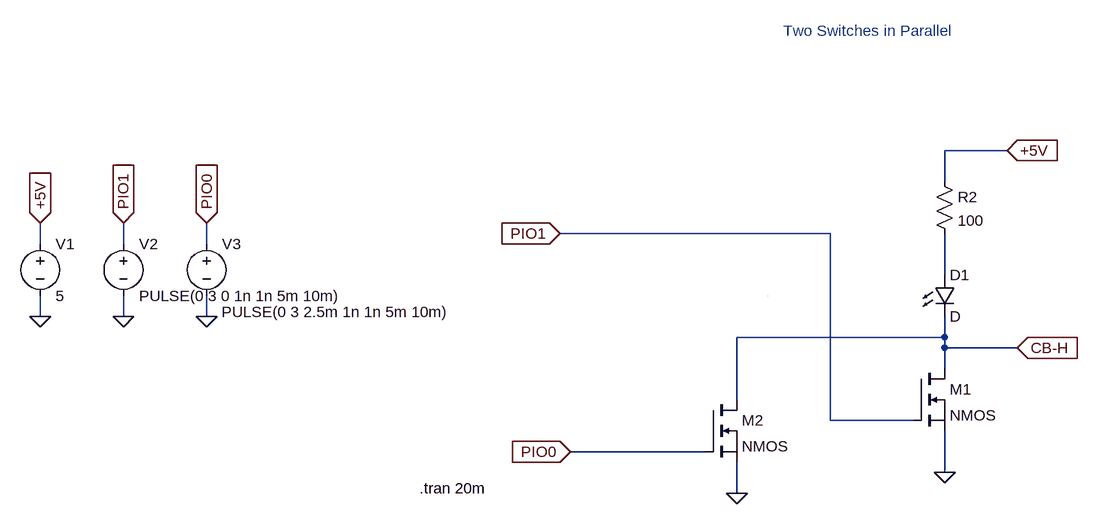
[diagram p0: schematic two_switches_parallel_ltspice.asc]
two_switches_parallel_ltspice.asc, the LTspice schematic file:
Version 4
SHEET 1 880 680
WIRE 368 -224 272 -224
WIRE 272 -176 272 -224
WIRE 96 -96 -320 -96
WIRE -1120 -80 -1120 -112
WIRE -992 -80 -992 -112
WIRE -864 -80 -864 -112
WIRE 272 -32 272 -96
WIRE -1120 32 -1120 0
WIRE -992 32 -992 0
WIRE -864 32 -864 0
WIRE 272 64 272 32
WIRE 272 64 -48 64
WIRE 272 80 272 64
WIRE 384 80 272 80
WIRE 272 112 272 80
WIRE -48 160 -48 64
WIRE 96 192 96 -96
WIRE 224 192 96 192
WIRE -96 240 -304 240
WIRE 272 272 272 208
WIRE -48 304 -48 256
WIRE 0 0 0 0
FLAG 272 272 0
FLAG 368 -224 +5V
IOPIN 368 -224 In
FLAG 384 80 CB-H
IOPIN 384 80 In
FLAG -320 -96 PIO1
IOPIN -320 -96 In
FLAG -1120 32 0
FLAG -992 32 0
FLAG -1120 -112 +5V
IOPIN -1120 -112 In
FLAG -992 -112 PIO1
IOPIN -992 -112 In
FLAG -48 304 0
FLAG -304 240 PIO0
IOPIN -304 240 In
FLAG -864 32 0
FLAG -864 -112 PIO0
IOPIN -864 -112 In
SYMBOL LED 256 -32 R0
SYMATTR InstName D1
SYMBOL res 256 -192 R0
SYMATTR InstName R2
SYMATTR Value 100
SYMBOL voltage -1120 -96 R0
WINDOW 123 0 0 Left 0
WINDOW 39 0 0 Left 0
SYMATTR InstName V1
SYMATTR Value 5
SYMBOL voltage -992 -96 R0
WINDOW 123 0 0 Left 0
WINDOW 39 0 0 Left 0
SYMATTR InstName V2
SYMATTR Value PULSE(0 3 0 1n 1n 5m 10m)
SYMBOL voltage -864 -96 R0
WINDOW 123 0 0 Left 0
WINDOW 39 0 0 Left 0
WINDOW 3 23 121 Left 2
SYMATTR Value PULSE(0 3 2.5m 1n 1n 5m 10m)
SYMATTR InstName V3
SYMBOL nmos 224 112 R0
SYMATTR InstName M1
SYMBOL nmos -96 160 R0
SYMATTR InstName M2
TEXT -536 296 Left 2 !.tran 20m
TEXT 24 -408 Left 2 ;Two Switches in Parallel

The netlist it stands for:
* two_switches_parallel_ltspice.asc
D1 N001 CB-H D
R2 +5V N001 100
V1 +5V 0 5
V2 PIO1 0 PULSE(0 3 0 1n 1n 5m 10m)
V3 PIO0 0 PULSE(0 3 2.5m 1n 1n 5m 10m)
M1 CB-H PIO1 0 0 NMOS
M2 CB-H PIO0 0 0 NMOS
.model D D
.lib standard.dio
.model NMOS NMOS
.model PMOS PMOS
.lib standard.mos
.tran 20m
* Two Switches in Parallel
.backanno
.end